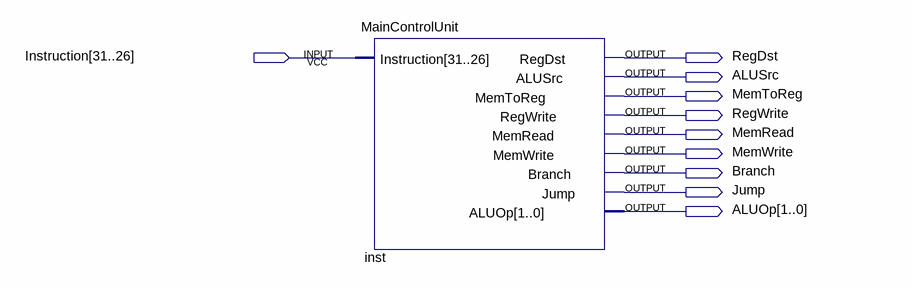
[diagram p0: schematic sheet]
// Quartus schematic component_test.bdf as structural Verilog: 1 symbols, 10 pins
module component_test (
  input  [31:26] Instruction,
  output RegDst,
  output ALUSrc,
  output MemToReg,
  output RegWrite,
  output MemRead,
  output MemWrite,
  output Branch,
  output Jump,
  output [1:0] ALUOp
);

  MainControlUnit inst (
    .Instruction(Instruction), .RegDst(RegDst), .ALUSrc(ALUSrc), .MemToReg(MemToReg), .RegWrite(RegWrite),
    .MemRead(MemRead), .MemWrite(MemWrite), .Branch(Branch), .Jump(Jump), .ALUOp(ALUOp));
endmodule
